# EasyEDA schematic SCH_MS5803 Adapter FFC_2023-08-02.json
TITLE: Sheet_1; REV: 1.0; Date: 2020-07-08; Sheet: 1/1; Drawn By: ted.langhorst; Company: Your Company
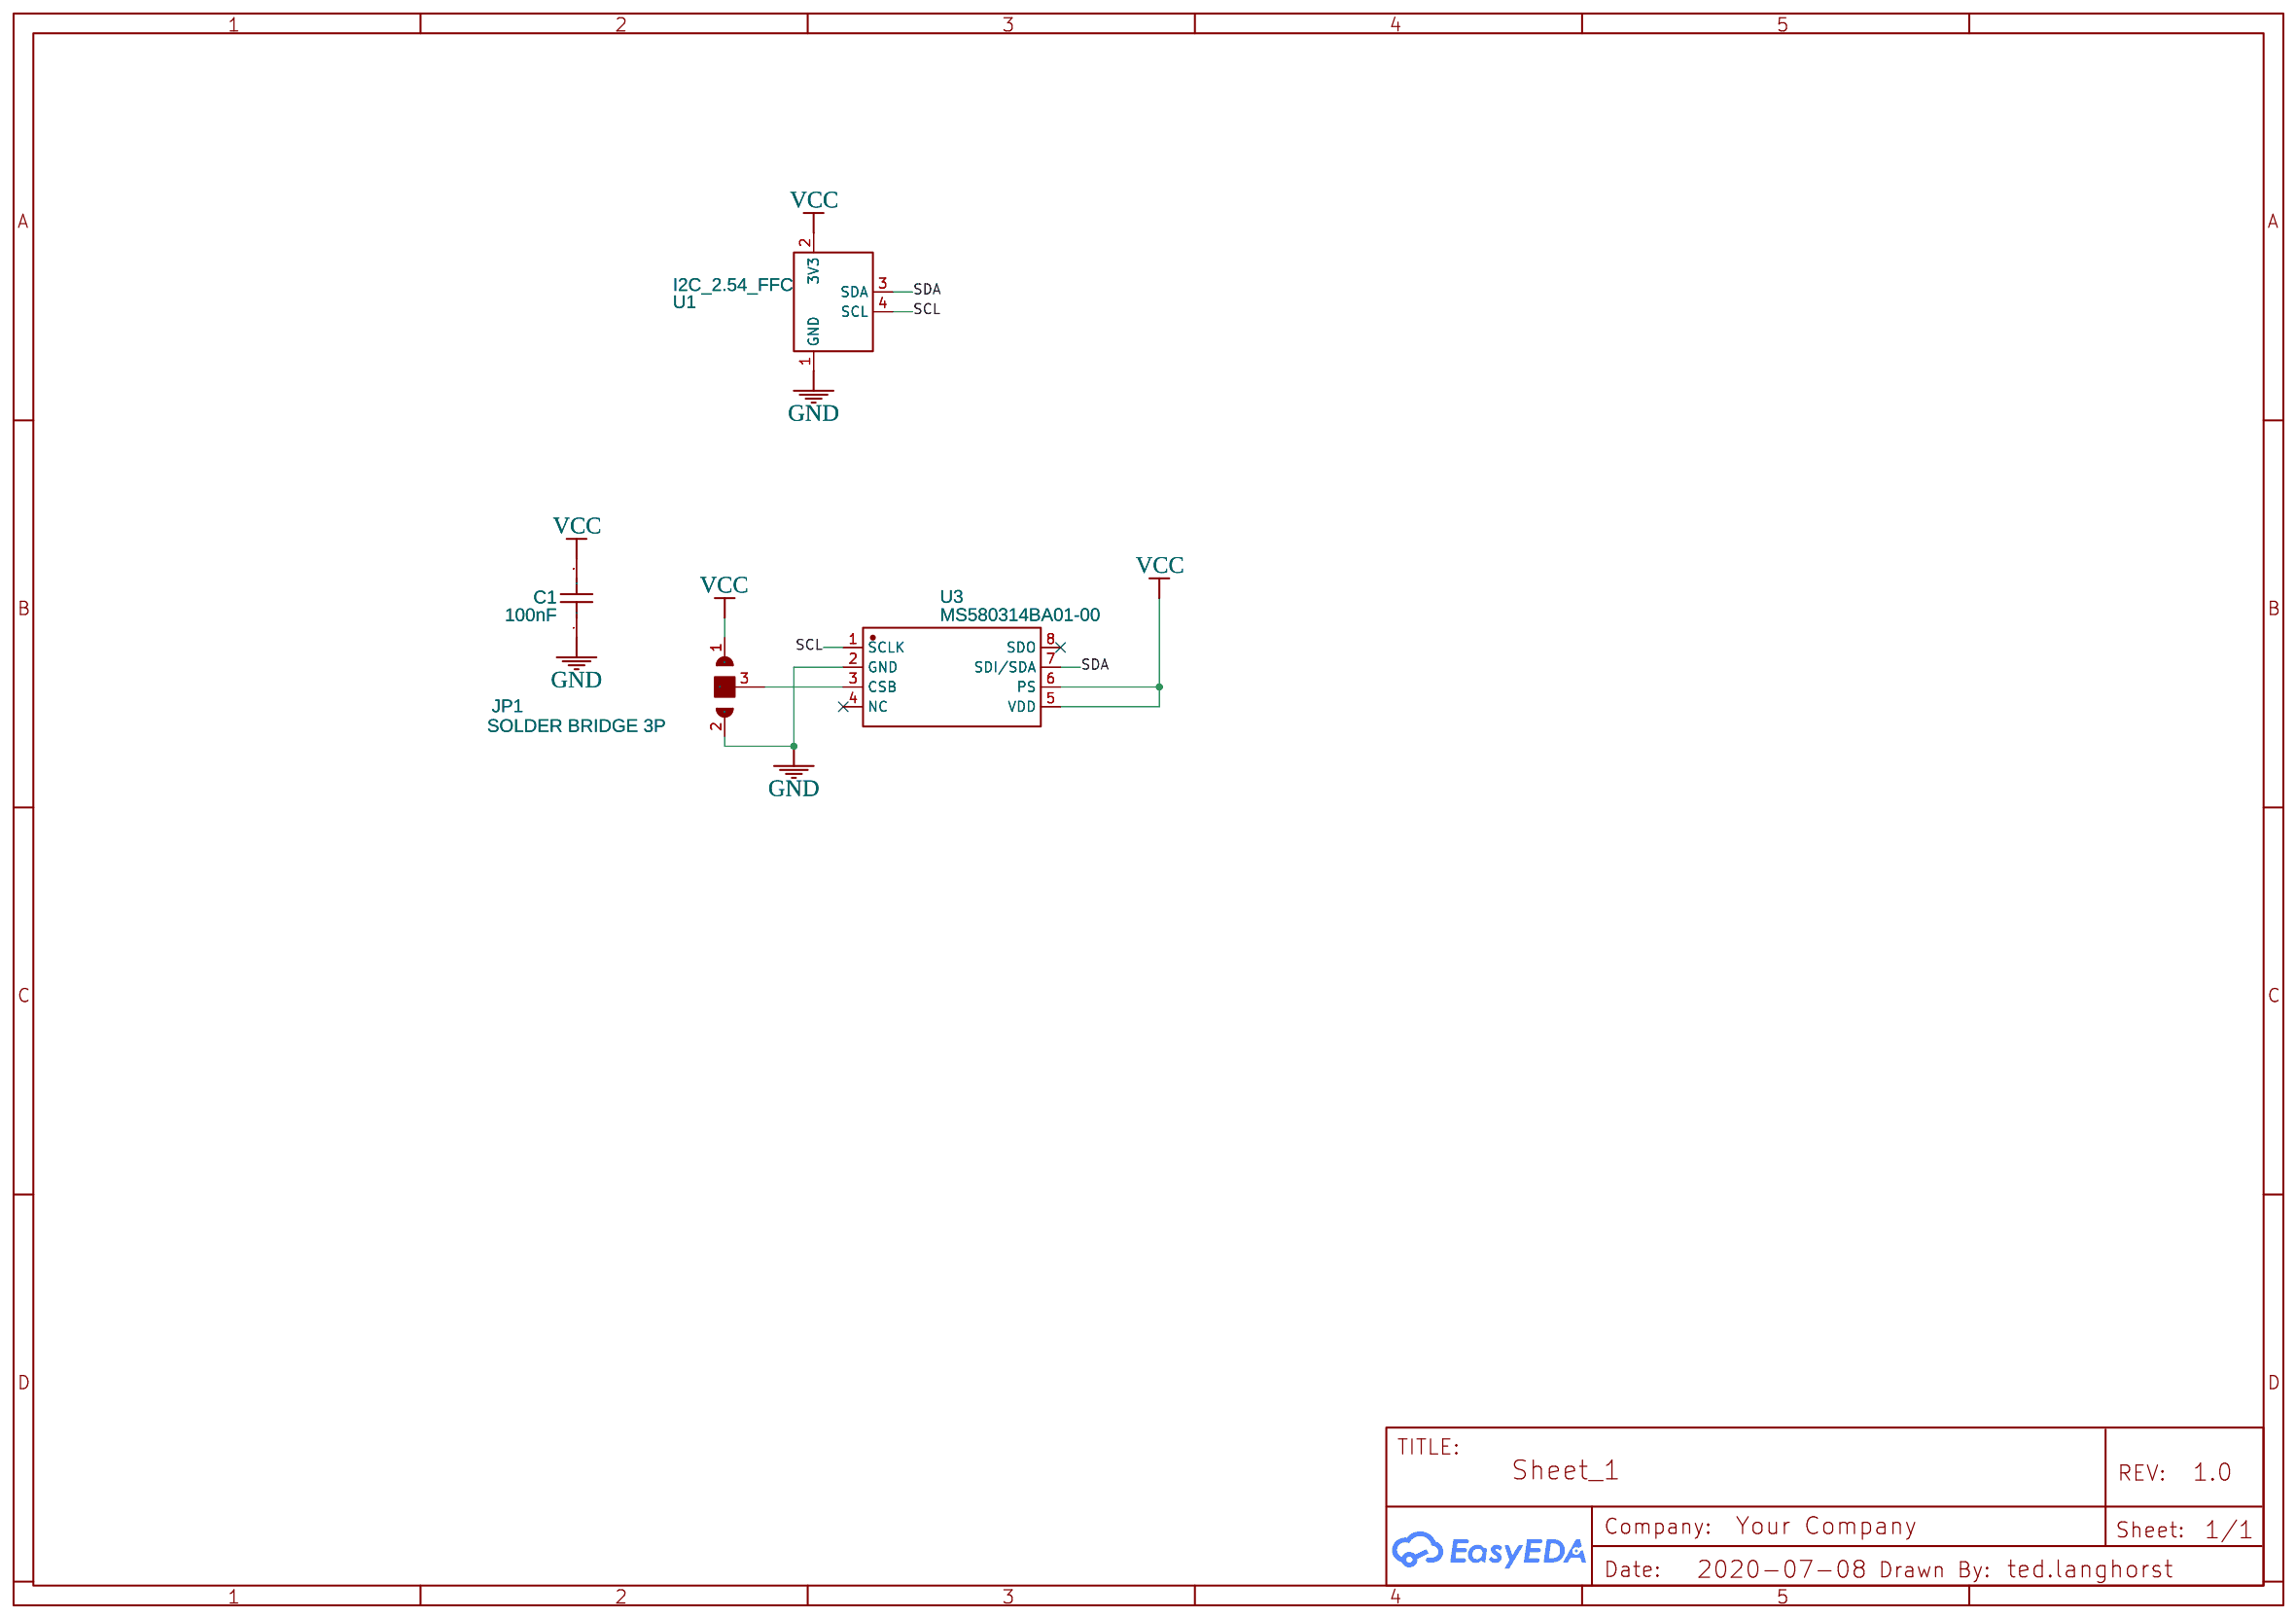
[diagram p0: schematic sheet]

## Parts
C1  100nF  [C0603]
JP1  SOLDER BRIDGE 3P  [SOLDER BRIDGE 3P UNBRIDGED]
U1  I2C_2.54_FFC  [1X4_2.54_FLATFLEX]
U3  MS580314BA01-00  [SMD-8_L6.4-W6.2-P1.25-TR]

## Library data of the parts
C1 = CC0603KRX7R9BB104: Supplier: LCSC; Manufacturer: YAGEO(国巨); Supplier Part: C14663; JLCPCB Part Class: Basic Part
JP1 = SOLDER BRIDGE: Contributor: teszt
U1 = I2C_2.54_FFC: Manufacturer: TE Connectivity AMP Connectors; Manufacturer Part: 5-1474644-0; Supplier: Digi-Key; Supplier Part: A128864-ND; link: https://www.digikey.com/en/products/detail/te-connectivity-amp-connectors/5-1474644-0/5400035; Contributor: ted.langhorst
U3 = MS580314BA01-00: Supplier: LCSC; Supplier Part: C5166455; Manufacturer: null; JLCPCB Part Class: Extended Part; Contributor: lcsc

## Nets
GND: C1.1 JP1.2 U1.1(GND) U3.2(GND)
VCC: C1.2 JP1.1 U1.2(3V3) U3.5(VDD) U3.6(PS)
SCL: U1.4(SCL) U3.1(SCLK)
SDA: U1.3(SDA) U3.7(SDI/SDA)
Net-(JP1-3): JP1.3 U3.3(CSB)

Not connected (* = marked no-connect by the designer): U3 4(NC)* 8(SDO)*
